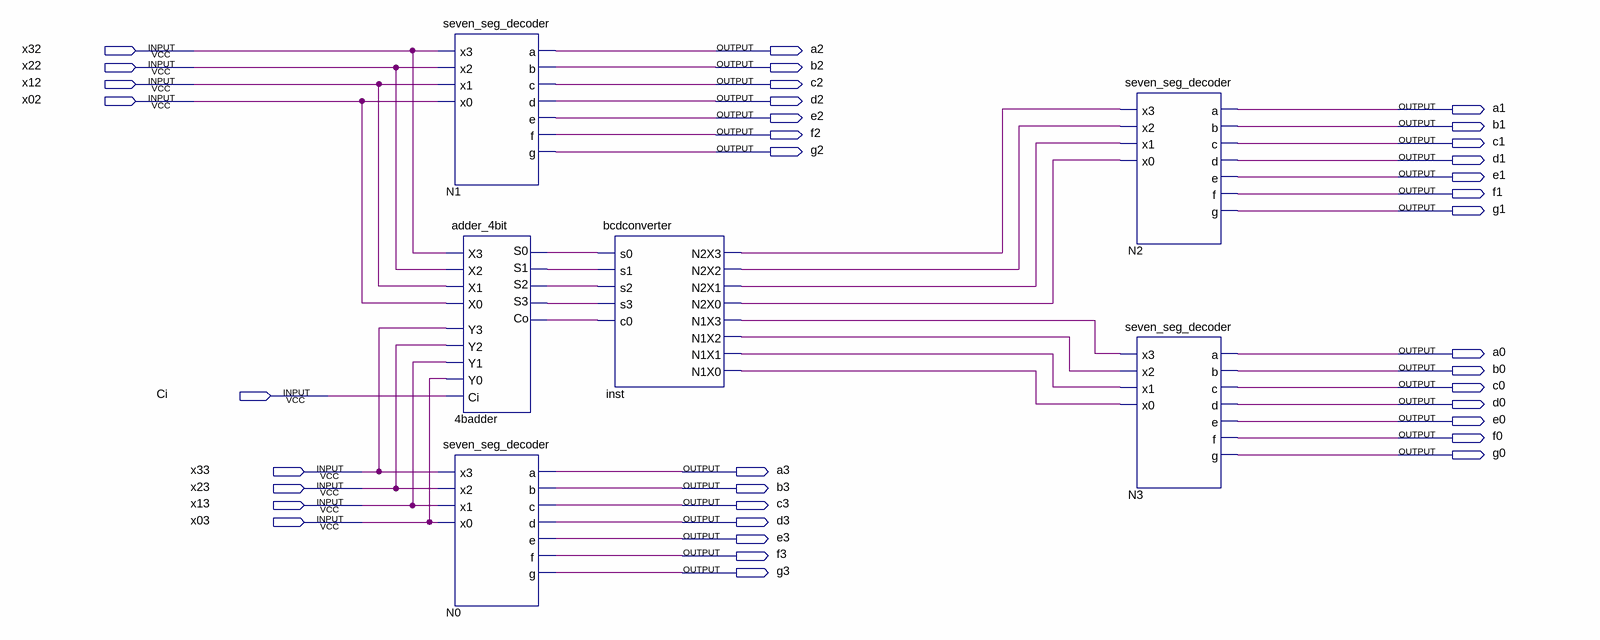
[diagram p0: schematic sheet]
// Quartus schematic Lab06.bdf as structural Verilog: 6 symbols, 37 pins
module Lab06 (
  input  x32,
  input  x22,
  input  x12,
  input  x02,
  input  Ci,
  input  x33,
  input  x23,
  input  x13,
  input  x03,
  output a2,
  output b2,
  output c2,
  output d2,
  output a1,
  output e2,
  output b1,
  output f2,
  output c1,
  output g2,
  output d1,
  output e1,
  output f1,
  output g1,
  output a0,
  output b0,
  output c0,
  output d0,
  output e0,
  output f0,
  output g0,
  output a3,
  output b3,
  output c3,
  output d3,
  output e3,
  output f3,
  output g3
);

  wire inst_n1x0, inst_n1x1, inst_n1x2, inst_n1x3, inst_n2x0, inst_n2x1, inst_n2x2, inst_n2x3, n4badder_co,
       n4badder_s0, n4badder_s1, n4badder_s2, n4badder_s3;

  seven_seg_decoder N1 (.x3(x32), .x2(x22), .x1(x12), .x0(x02), .a(a2), .b(b2), .c(c2), .d(d2), .e(e2), .f(f2), .g(g2));
  adder_4bit u_4badder (
    .X3(x32), .Y3(x33), .X2(x22), .Y2(x23), .X1(x12), .Y1(x13), .X0(x02), .Y0(x03), .Ci(Ci),
    .S0(n4badder_s0), .S1(n4badder_s1), .S2(n4badder_s2), .S3(n4badder_s3), .Co(n4badder_co));
  seven_seg_decoder N0 (.x3(x33), .x2(x23), .x1(x13), .x0(x03), .a(a3), .b(b3), .c(c3), .d(d3), .e(e3), .f(f3), .g(g3));
  bcdconverter inst (
    .s0(n4badder_s0), .s1(n4badder_s1), .s2(n4badder_s2), .s3(n4badder_s3), .c0(n4badder_co),
    .N2X3(inst_n2x3), .N2X2(inst_n2x2), .N2X1(inst_n2x1), .N2X0(inst_n2x0), .N1X3(inst_n1x3),
    .N1X2(inst_n1x2), .N1X1(inst_n1x1), .N1X0(inst_n1x0));
  seven_seg_decoder N2 (
    .x3(inst_n2x3), .x2(inst_n2x2), .x1(inst_n2x1), .x0(inst_n2x0), .a(a1), .b(b1), .c(c1), .d(d1), .e(e1),
    .f(f1), .g(g1));
  seven_seg_decoder N3 (
    .x3(inst_n1x3), .x2(inst_n1x2), .x1(inst_n1x1), .x0(inst_n1x0), .a(a0), .b(b0), .c(c0), .d(d0), .e(e0),
    .f(f0), .g(g0));
endmodule
